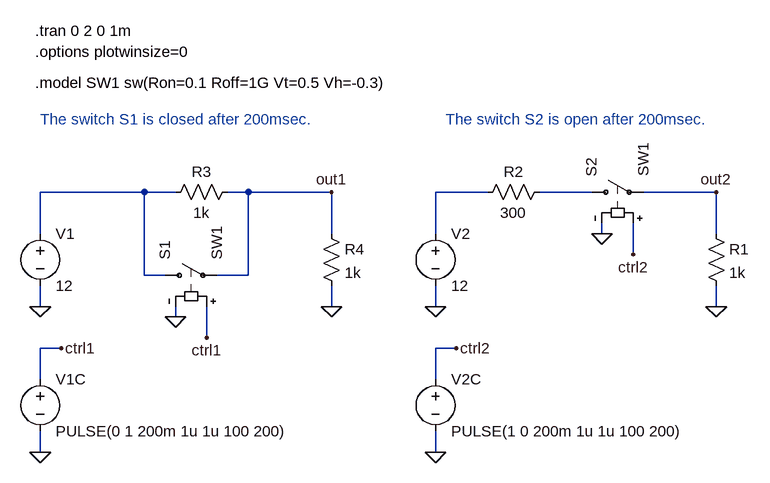
[diagram p0: schematic ResistorFailure.asc]
ResistorFailure.asc, the LTspice schematic file:
Version 4
SHEET 1 984 804
WIRE -64 384 -224 384
WIRE -16 384 -64 384
WIRE 96 384 64 384
WIRE 224 384 96 384
WIRE 464 384 384 384
WIRE 624 384 544 384
WIRE 816 384 704 384
WIRE -224 448 -224 384
WIRE 224 448 224 384
WIRE 384 448 384 384
WIRE 640 448 640 432
WIRE 816 448 816 384
WIRE 688 480 688 432
WIRE -64 512 -64 384
WIRE -32 512 -64 512
WIRE 96 512 96 384
WIRE 96 512 48 512
WIRE -224 560 -224 528
WIRE 224 560 224 528
WIRE 384 560 384 528
WIRE 816 560 816 528
WIRE -16 576 -16 560
WIRE 32 608 32 560
WIRE -192 624 -224 624
WIRE 416 624 384 624
WIRE -224 672 -224 624
WIRE 384 672 384 624
WIRE -224 784 -224 752
WIRE 384 784 384 752
FLAG 224 560 0
FLAG -224 560 0
FLAG 224 384 out1
FLAG -16 576 0
FLAG 32 608 ctrl1
FLAG -224 784 0
FLAG -192 624 ctrl1
FLAG 816 560 0
FLAG 384 560 0
FLAG 816 384 out2
FLAG 640 448 0
FLAG 384 784 0
FLAG 416 624 ctrl2
FLAG 688 480 ctrl2
SYMBOL res 208 432 R0
SYMATTR InstName R4
SYMATTR Value 1k
SYMBOL voltage -224 432 R0
SYMATTR InstName V1
SYMATTR Value 12
SYMBOL res -32 400 R270
WINDOW 0 32 56 VTop 0
WINDOW 3 0 56 VBottom 0
SYMATTR InstName R3
SYMATTR Value 1k
SYMBOL sw -48 512 R270
SYMATTR InstName S1
SYMATTR Value SW1
SYMBOL voltage -224 656 R0
WINDOW 123 0 0 Left 0
WINDOW 39 0 0 Left 0
SYMATTR InstName V1C
SYMATTR Value PULSE(0 1 200m 1u 1u 100 200)
SYMBOL res 800 432 R0
SYMATTR InstName R1
SYMATTR Value 1k
SYMBOL voltage 384 432 R0
SYMATTR InstName V2
SYMATTR Value 12
SYMBOL res 448 400 R270
WINDOW 0 32 56 VTop 0
WINDOW 3 0 56 VBottom 0
SYMATTR InstName R2
SYMATTR Value 300
SYMBOL sw 608 384 R270
SYMATTR InstName S2
SYMATTR Value SW1
SYMBOL voltage 384 656 R0
WINDOW 123 0 0 Left 0
WINDOW 39 0 0 Left 0
SYMATTR InstName V2C
SYMATTR Value PULSE(1 0 200m 1u 1u 100 200)
TEXT -232 136 Left 0 !.tran 0 2 0 1m
TEXT -232 216 Left 0 !.model SW1 sw(Ron=0.1 Roff=1G Vt=0.5 Vh=-0.3)
TEXT -232 168 Left 0 !.options plotwinsize=0
TEXT -224 272 Left 0 ;The switch S1 is closed after 200msec.
TEXT 400 272 Left 0 ;The switch S2 is open after 200msec.

The netlist it stands for:
* ResistorFailure.asc
R4 out1 0 1k
V1 N001 0 12
R3 N001 out1 1k
S1 N001 out1 ctrl1 0 SW1
V1C ctrl1 0 PULSE(0 1 200m 1u 1u 100 200)
R1 out2 0 1k
V2 N002 0 12
R2 N002 N003 300
S2 N003 out2 ctrl2 0 SW1
V2C ctrl2 0 PULSE(1 0 200m 1u 1u 100 200)
.tran 0 2 0 1m
.model SW1 sw(Ron=0.1 Roff=1G Vt=0.5 Vh=-0.3)
.options plotwinsize=0
* The switch S1 is closed after 200msec.
* The switch S2 is open after 200msec.
.backanno
.end